# Altium schematic sheet PowerBoardSchematicV2.SchDoc: EEE3061W Design Project - Power Board
size A4; DrawnBy: Team 13; DocumentNumber: 3; Revision: 2
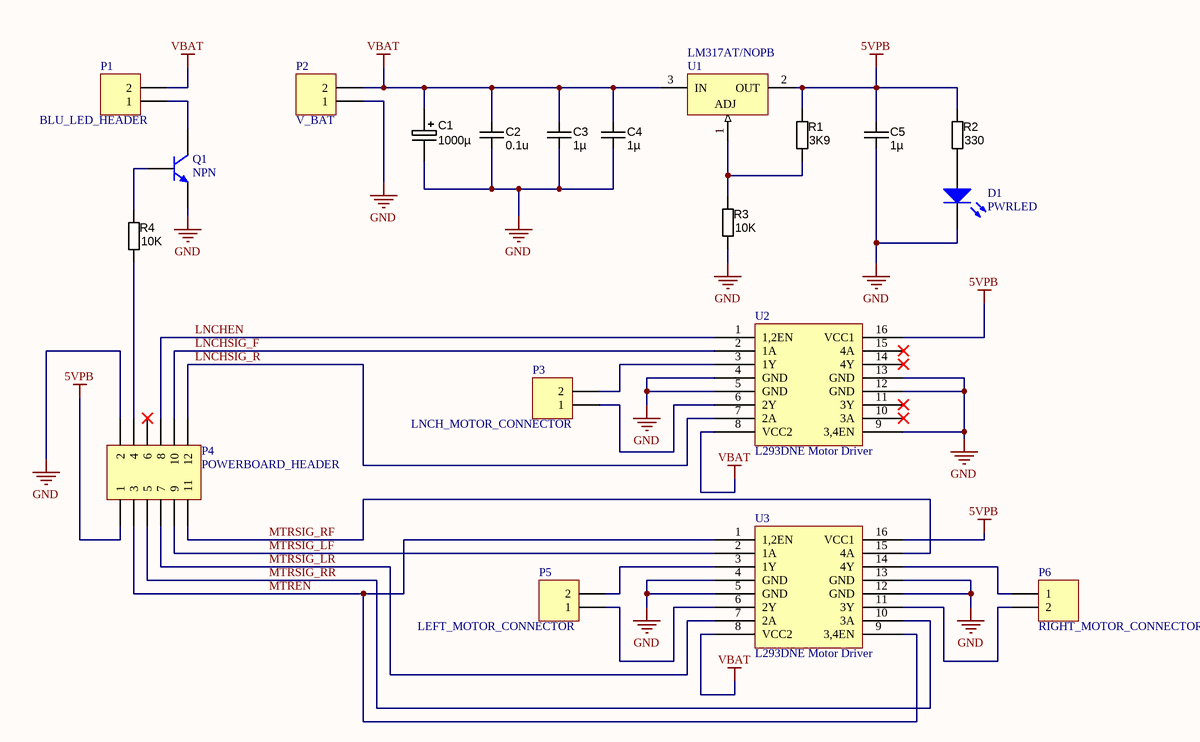
[diagram p0: PowerBoardSchematicV2.SchDoc]

## Parts
C1  1000µ  [CAPE5.0mm]
C2  value 0.1u  [CAPC2012X135N]  (hidden comment: approved sub OK)
C3  value 1µ  [CAPC3216X180N]  (hidden comment: approved sub OK)
C4  value 1µ  [CAPC3216X180N]  (hidden comment: approved sub OK)
C5  value 1µ  [CAPC3216X180N]  (hidden comment: approved sub OK)
D1  PWRLED  [3.5X2.8X1.9]
P1  BLU_LED_HEADER  [HDR1X2]
P2  V_BAT  [HDR1X2]
P3  LNCH_MOTOR_CONNECTOR  [HDR1X2]
P4  POWERBOARD_HEADER  [HDR2X6]
P5  LEFT_MOTOR_CONNECTOR  [HDR1X2]
P6  RIGHT_MOTOR_CONNECTOR  [HDR1X2]
Q1  NPN  [TO-226-AA]
R1  3K9  [RESC2012X70N]
R2  330  [RESC2012X70N]
R3  10K  [RESC2012X70N]
R4  10K  [RESC2012N_ZERO]
U1  LM317AT/NOPB  [T03B]
U2  L293DNE Motor Driver  [DIP16 (NE)]
U3  L293DNE Motor Driver  [DIP16 (NE)]

## Nets
5VPB: C5.1 P4.1 R1.1 R2.1 U1.2(OUT) U2.16(VCC1) U3.16(VCC1)
GND: C1.2 C2.2 C3.2 C4.2 C5.2 D1.2(K) P2.1 P4.2 Q1.3(E) R3.2 U2.4(GND) U2.5(GND) U2.9(3,4EN) U2.12(GND) U2.13(GND) U3.4(GND) U3.5(GND) U3.12(GND) U3.13(GND)
VBAT: C1.1 C2.1 C3.1 C4.1 P1.2 P2.2 U1.3(IN) U2.8(VCC2) U3.8(VCC2)
LNCHEN: P4.8 U2.1(1,2EN)
LNCHSIG_F: P4.10 U2.2(1A)
LNCHSIG_R: P4.12 U2.7(2A)
MTREN: P4.3 U3.1(1,2EN) U3.9(3,4EN)
MTRSIG_LF: P4.9 U3.2(1A)
MTRSIG_LR: P4.7 U3.7(2A)
MTRSIG_RF: P4.11 U3.15(4A)
MTRSIG_RR: P4.5 U3.10(3A)
NetD1_1: D1.1(A) R2.2
NetP1_1: P1.1 Q1.1(C)
NetP3_1: P3.1 U2.6(2Y)
NetP3_2: P3.2 U2.3(1Y)
NetP4_4: P4.4 R4.2
NetP5_1: P5.1 U3.6(2Y)
NetP5_2: P5.2 U3.3(1Y)
NetP6_1: P6.1 U3.14(4Y)
NetP6_2: P6.2 U3.11(3Y)
NetQ1_2: Q1.2(B) R4.1
NetR1_2: R1.2 R3.1 U1.1(ADJ)

Not connected (* = marked no-connect by the designer): P4 6*; U2 10(3A)* 11(3Y)* 14(4Y)* 15(4A)*

## Library data of the parts
C1 = CAPE_33u_200V_THT: Capacitor THT Alum Elec 33uF 20% 200V; Manufacturer 1: Panasonic - ECG; Manufacturer Part Number 1: EEU-ED2D330; Ratings: 200V; 105°C; Material: Al; SCDType: undef; Package / Case: Radial; Tolerance: ±20%; Supplier 1: Digi-Key; Supplier Part Number 1: P13523-ND; Value: 1000µ
C2 = CAPC_1n8_50V_0805: Capacitor SMD Cer 1.8nF 10% 50V X7R 0805; Manufacturer 1: AVX Corporation; Manufacturer Part Number 1: 08055C182KAT2A; Ratings: 50V; X7R; SCDType: source*; Tolerance: ±10%; Operating Temperature: -55°C ~ 125°C; Package / Case: 0805 (2012 metric); Supplier 1: Digi-Key; Supplier Part Number 1: 478-1374-1-ND
C3-C5 = CAPC_10u_1206_16V: Capacitor SMD Cer 10uF 10% 16V X7R 1206; Manufacturer 1: Kemet; Manufacturer Part Number 1: C1206C106K4RACTU; Ratings: 16V; X7R; Material: ceramic; SCDType: spec; Package / Case: 1206 (3216 metric); Tolerance: ±10%; Supplier 1: Digi-Key; Supplier Part Number 1: 399-3525-1-ND
D1 = LED3: Typical BLUE SiC LED; Published: 8-Jun-2000; LatestRevisionDate: 17-Dec-2003; LatestRevisionNote: PCB Footprint replaced.; DatasheetVersion: 16-Apr-2002; PackageVersion: 16-Apr-2002; PackageReference: 3.5X2.8X1.9; Publisher: Altium Limited; PackageDescription: SM LED; 2 C-Bend Leads; Body 3.5 x 2.8 x 1.9 mm, inc leads (LxWxH typ)
P1-P3 P5 P6 = Header 2: Header, 2-Pin; LatestRevisionDate: 17-Jul-2002; LatestRevisionNote: Re-released for DXP Platform.; Publisher: Altium Limited
P4 = Header 6X2: Header, 6-Pin, Dual row; LatestRevisionDate: 17-Jul-2002; LatestRevisionNote: Re-released for DXP Platform.; Publisher: Altium Limited
Q1 = NPN: NPN Bipolar Transistor; Published: 8-Jun-2000; LatestRevisionDate: 17-Jul-2002; LatestRevisionNote: Re-released for DXP Platform.; PackageReference: TO-226-AA; Publisher: Altium Limited; PackageDescription: TO, Flat Index; 3 In-Line, Axial Leads; Body Dia. 4.8mm; Leads 0.55 x 0.51 mm (max); Code_JEDEC: TO-226-AA
R1-R3 = RES_10K_0805_5%: Resistor SMD chip 10k Ohm 0.125W 5% 0805; Manufacturer 1: Yageo; Manufacturer Part Number 1: RC0805JR-0710KL; Ratings: 1/8 W; SCDType: spec; Package / Case: 0805 (2012 metric); Tolerance: ±5%; Material: Thick Film; Supplier 1: Digi-Key; Supplier Part Number 1: 311-10KARCT-ND
  R1: Value: 3K9
  R2: Value: 330
  R3: Value: 10K
R4 = RES_0R_0805: Resistor SMD chip 0.0 Ohm 0.125W 0805; Manufacturer 1: Samsung Electro-Mechanics America, Inc; Manufacturer Part Number 1: RC2012J000CS; Ratings: 1/8W; SCDType: spec; Tolerance: N/A; Package / Case: 0805 (2012 metric); Supplier 1: Digi-Key; Supplier Part Number 1: 1276-5466-6-ND; RoHS 1: RoHS Compliant; ComponentLink1URL: http://www.samsungsem.com/servlet/FileDownload?filename=productcatalog/pdf/Chip_Resistor.pdf; ComponentLink1Description: http://www.samsungsem.com/servlet/FileDownload?filename=productcatalog/pdf/Chip_Resistor.pdf; Supplier 2: Digi-Key; Supplier Part Number 2: RMCF0805ZT0R00DKR-ND; Manufacturer 2: Stackpole Electronics Inc; Manufacturer Part Number 2: RMCF0805ZT0R00; RoHS 2: RoHS Compliant; ComponentLink2URL: http://www.seielect.com/Catalog/SEI-RMCF_RMCP.pdf; ComponentLink2Description: http://www.seielect.com/Catalog/SEI-RMCF_RMCP.pdf; Supplier 3: Digi-Key; Supplier Part Number 3: 311-0.0ARDKR-ND; Manufacturer 3: Yageo; Manufacturer Part Number 3: RC0805JR-070RL; RoHS 3: RoHS Compliant; ComponentLink3URL: http://media.digikey.com/pdf/Data%20Sheets/Yageo%20PDFs/RC0805%20Pb%20Free.pdf; ComponentLink3Description: http://media.digikey.com/pdf/Data%20Sheets/Yageo%20PDFs/RC0805%20Pb%20Free.pdf; Supplier 4: Digi-Key; Supplier Part Number 4: P0.0ADKR-ND; Manufacturer 4: Panasonic Electronic Components; Manufacturer Part Number 4: ERJ-6GEY0R00V; RoHS 4: RoHS Compliant; ComponentLink4URL: http://industrial.panasonic.com/www-cgi/jvcr13pz.cgi?E+PZ+3+AOA0001+ERJ6GEY0R00V+7+WW; ComponentLink4Description: http://industrial.panasonic.com/www-cgi/jvcr13pz.cgi?E+PZ+3+AOA0001+ERJ6GEY0R00V+7+WW; Supplier 5: Digi-Key; Supplier Part Number 5: RHM0.0CPDKR-ND; Manufacturer 5: Rohm Semiconductor; Manufacturer Part Number 5: MCR10ERTJ000; RoHS 5: RoHS Compliant; ComponentLink5URL: http://rohmfs.rohm.com/en/products/databook/datasheet/passive/resistor/chip_resistor/mcr_g.pdf; ComponentLink5Description: http://rohmfs.rohm.com/en/products/databook/datasheet/passive/resistor/chip_resistor/mcr_g.pdf; Value: 10K
U1 = CMP-0062-02452-1: 3-Terminal Adjustable Regulator, 3-pin TO-220, Pb-Free; Manufacturer: National Semiconductor; CompType: LDO IC; PowerWise: N; PackageTopMarking: NSUZXYTTE#*LM317AT P+; DatasheetVersion: Apr-2007; PinCount: 3; PackageDescription: TO-220, Molded, 3 Lead, Straight; PackageVersion: revL, Jan-1992; PackageReference: T03B; RoHS: Y
U2 U3 = L293DNE: TI L293DNE Quad H-bridge Motor Driver